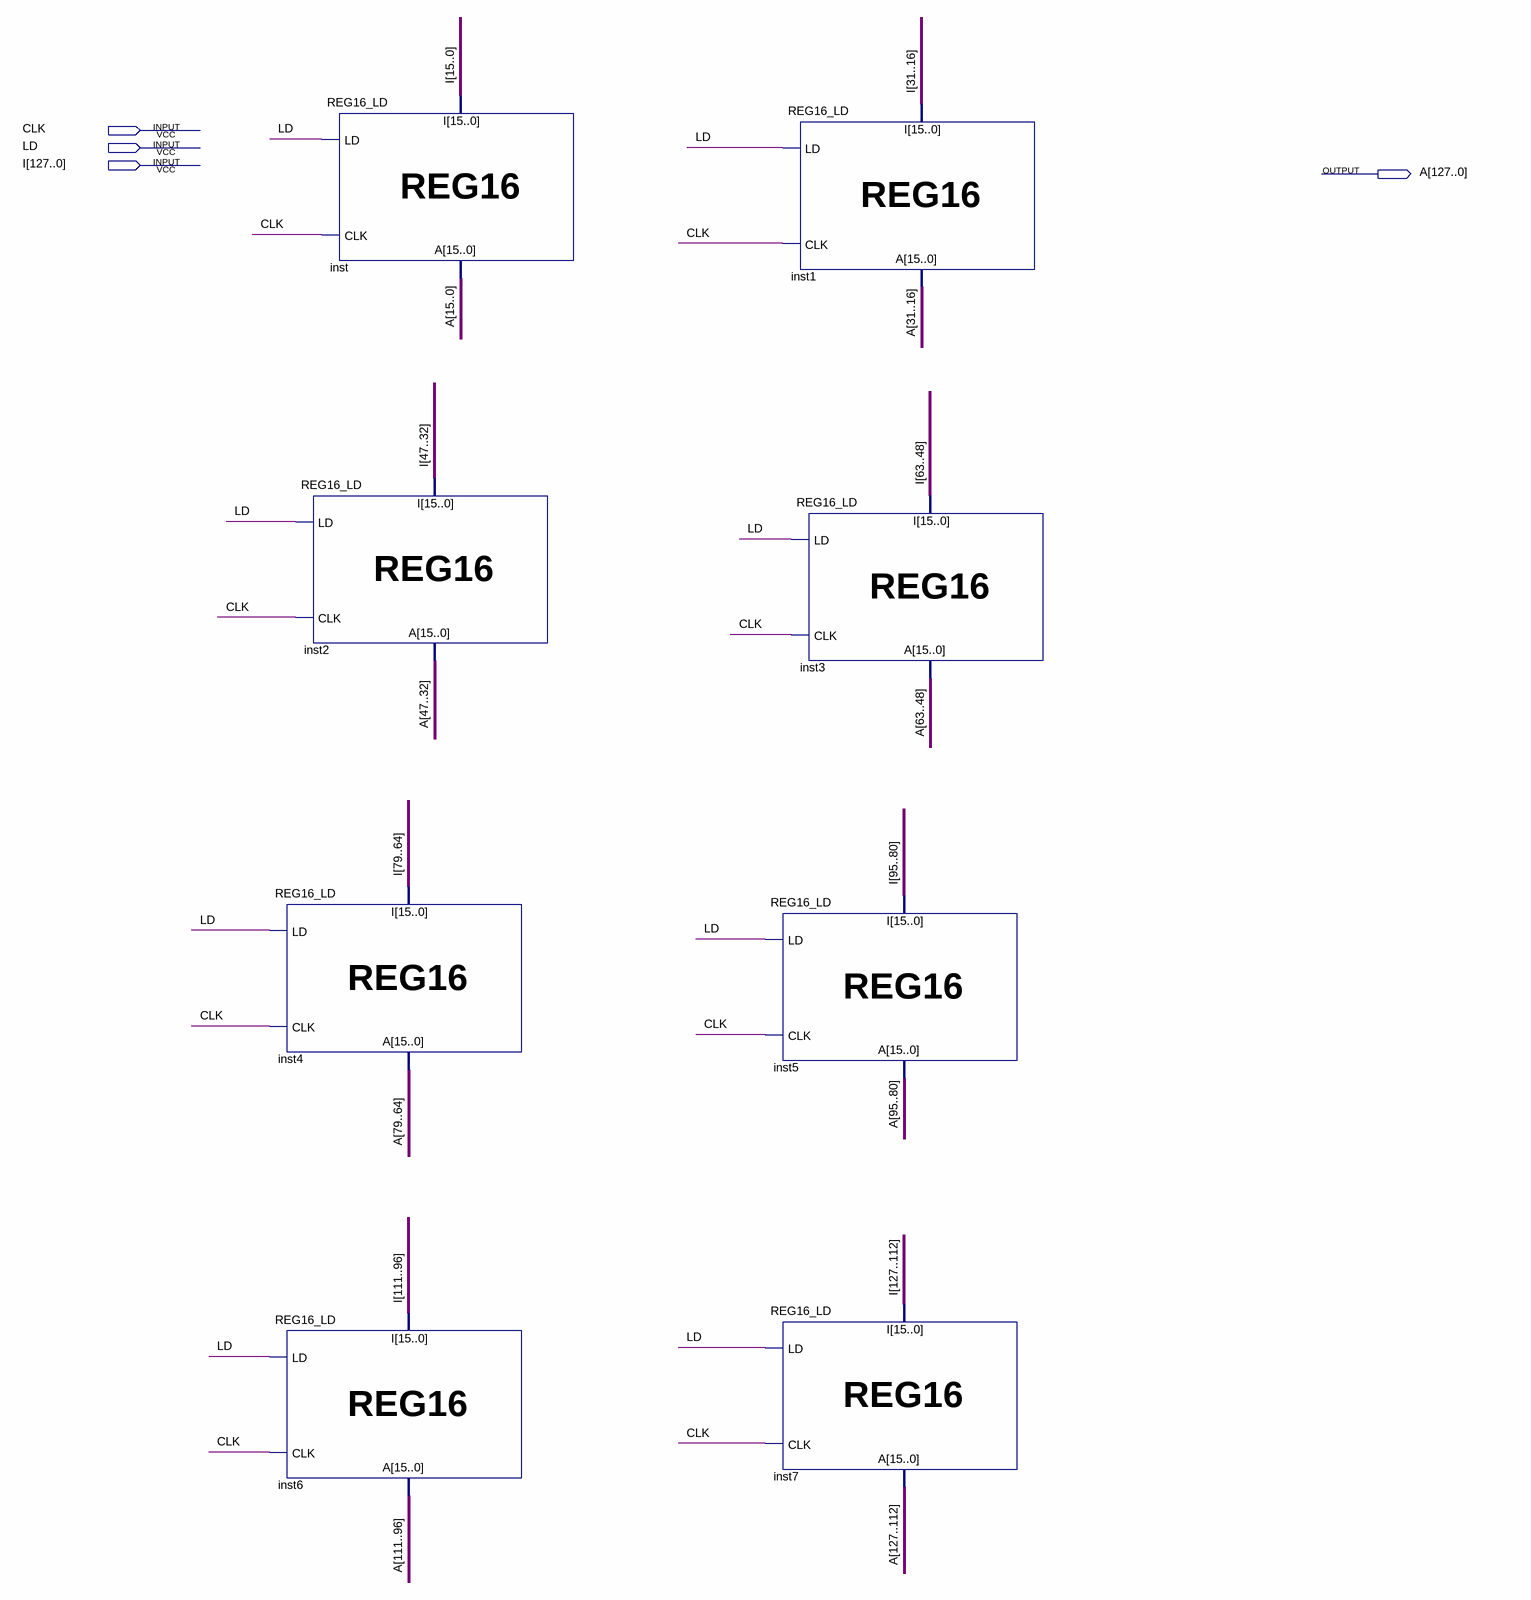
[diagram p0: schematic sheet]
// Quartus schematic CW.bdf as structural Verilog: 8 symbols, 4 pins
module CW (
  input  CLK,
  input  LD,
  input  [127:0] I,
  output [127:0] A
);

  REG16_LD inst4 (.I(I[79:64]), .CLK(CLK), .LD(LD), .A(A[79:64]));
  REG16_LD inst6 (.I(I[111:96]), .CLK(CLK), .LD(LD), .A(A[111:96]));
  REG16_LD inst (.I(I[15:0]), .CLK(CLK), .LD(LD), .A(A[15:0]));
  REG16_LD inst2 (.I(I[47:32]), .CLK(CLK), .LD(LD), .A(A[47:32]));
  REG16_LD inst5 (.I(I[95:80]), .CLK(CLK), .LD(LD), .A(A[95:80]));
  REG16_LD inst7 (.I(I[127:112]), .CLK(CLK), .LD(LD), .A(A[127:112]));
  REG16_LD inst1 (.I(I[31:16]), .CLK(CLK), .LD(LD), .A(A[31:16]));
  REG16_LD inst3 (.I(I[63:48]), .CLK(CLK), .LD(LD), .A(A[63:48]));
endmodule
